# EAGLE design breakout (EAGLE 7.5.0)
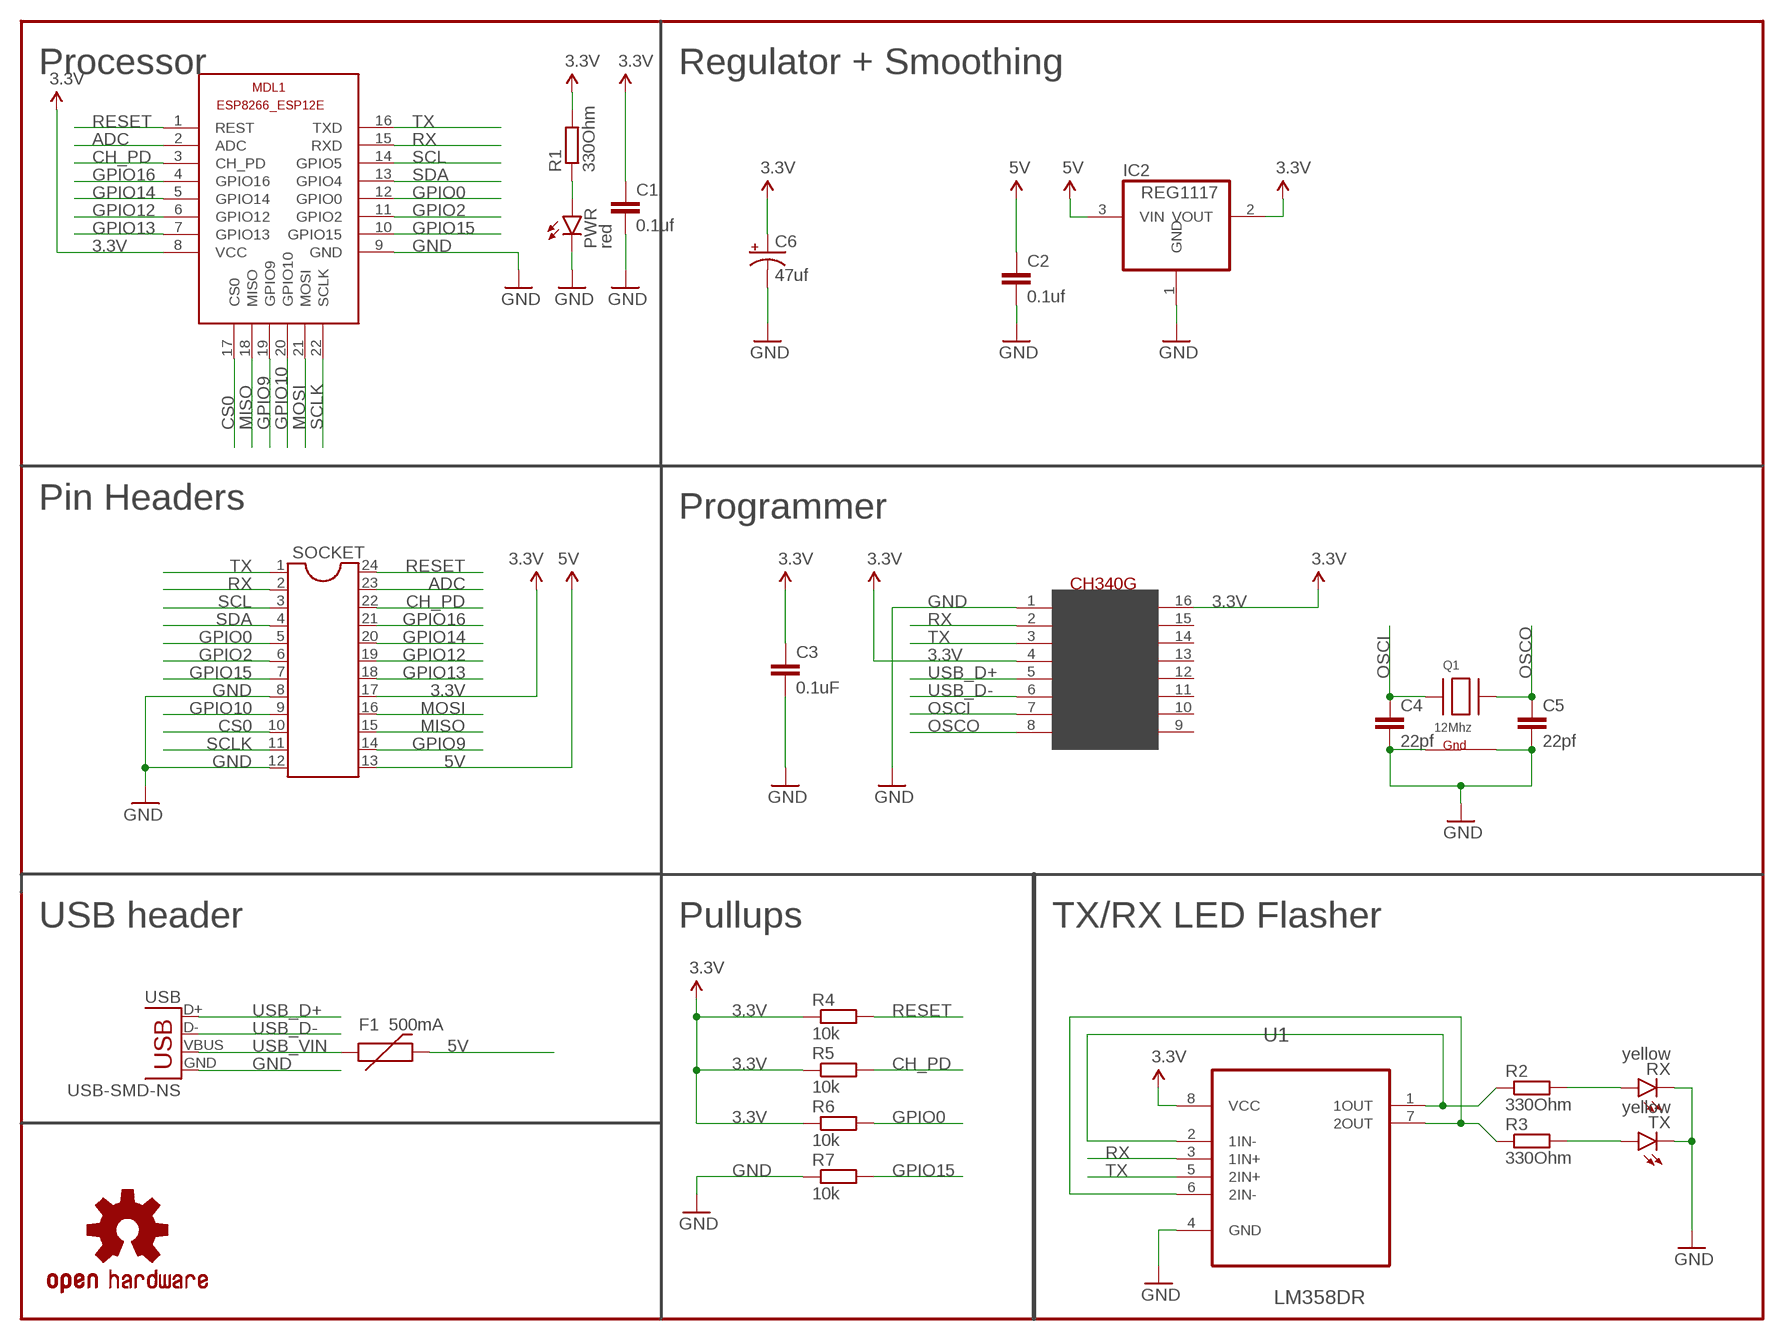
[diagram p0: schematic, sheet 1]

## Parts
C1  0.1uf  C-EUC0805  [C0805]
C2  0.1uf  C-EUC0805  [C0805]
C3  0.1uF  C-EUC0805  [C0805]
C4  22pf  C-EUC0805  [C0805]
C5  22pf  C-EUC0805  [C0805]
C6  47uf  CAP_POLC  [PANASONIC_C]
F1  500mA  PTCSMD  [PTC-1206]
FRAME1  FRAME-LETTERNO_PACKAGE  [DUMMY]
IC2  REG1117  [SOT223]
LOGO1  OSHW-LOGOS  [OSHW-LOGO-S]
MDL1  ESP8266-12EESP8266-ESP12E  [ESP8266-ESP12E]
PWR  red  LED0603  [LED-0603]
Q1  12Mhz  XTAL-4-3225  [NX3225]
R1  330Ohm  R-EU_R0805  [R0805]
R2  330Ohm  R-EU_R0805  [R0805]
R3  330Ohm  R-EU_R0805  [R0805]
R4  10k  R-EU_R0805  [R0805]
R5  10k  R-EU_R0805  [R0805]
R6  10k  R-EU_R0805  [R0805]
R7  10k  R-EU_R0805  [R0805]
RX  yellow  LED0603  [LED-0603]
SOCKET  DIL24-9  [DIL24-9]
TX  yellow  LED0603  [LED-0603]
U1  LM358DR  [SOIC127P600X175-8N]
U$1  CH340G  [SOIC16]
USB  USB-SMD-NS  [USB-MINIB-NOSTOP]

## Nets
3.3V: C1.1 C3.1 C6.+ IC2.2(VOUT) MDL1.8(VCC) R1.2 R4.1 R5.1 R6.1 SOCKET.17 U1.8(VCC) U$1.4(V3) U$1.16(VCC)
5V: C2.1 F1.2 IC2.3(VIN) SOCKET.13
ADC: MDL1.2(ADC) SOCKET.23
CH_PD: MDL1.3(CH_PD) R5.2 SOCKET.22
CS0: MDL1.17(CS0) SOCKET.10
GND: C1.2 C2.2 C3.2 C4.2 C5.2 C6.- IC2.1(GND) MDL1.9(GND) PWR.C Q1.2(G2) Q1.4(G1) R7.1 RX.C SOCKET.8 SOCKET.12 TX.C U1.4(GND) U$1.1(GND) USB.GND
GPIO0: MDL1.12(GPIO0) R6.2 SOCKET.5
GPIO2: MDL1.11(GPIO2) SOCKET.6
GPIO9: MDL1.19(GPIO9) SOCKET.14
GPIO10: MDL1.20(GPIO10) SOCKET.9
GPIO12: MDL1.6(GPIO12) SOCKET.19
GPIO13: MDL1.7(GPIO13) SOCKET.18
GPIO14: MDL1.5(GPIO14) SOCKET.20
GPIO15: MDL1.10(GPIO15) R7.2 SOCKET.7
GPIO16: MDL1.4(GPIO16) SOCKET.21
MISO: MDL1.18(MISO) SOCKET.15
MOSI: MDL1.21(MOSI) SOCKET.16
N$1: PWR.A R1.1
N$2: R3.2 TX.A
N$3: R2.1 U1.1(1OUT) U1.2(1IN-)
N$4: R3.1 U1.6(2IN-) U1.7(2OUT)
N$5: R2.2 RX.A
OSCI: C4.1 Q1.1(X1) U$1.7(XI)
OSCO: C5.1 Q1.3(X2) U$1.8(XO)
RESET: MDL1.1(REST) R4.2 SOCKET.24
RX: MDL1.15(RXD) SOCKET.2 U1.3(1IN+) U$1.2(TX)
SCL: MDL1.14(GPIO5) SOCKET.3
SCLK: MDL1.22(SCLK) SOCKET.11
SDA: MDL1.13(GPIO4) SOCKET.4
TX: MDL1.16(TXD) SOCKET.1 U1.5(2IN+) U$1.3(RX)
USB_D+: U$1.5(D+) USB.D+
USB_D-: U$1.6(D-) USB.D-
USB_VIN: F1.1 USB.VBUS
Unconnected: U$1.9(CTS) U$1.10(DSR) U$1.11(RI) U$1.12(DCD) U$1.13(DTR) U$1.14(RTS) U$1.15(RS232)

## Notes on the sheet
- Processor | Regulator + Smoothing
- Pin Headers
- Programmer
- USB header | Pullups | TX/RX LED Flasher

## Library data of the parts
C1-C5 = rcl:C-EU: CAPACITOR, European symbol
C6 = SparkFun:CAP_POL: Capacitor Polarized These are standard SMD and PTH capacitors. Normally 10uF, 47uF, and 100uF in electrolytic and tantalum varieties. Always verify the external diameter of the through hole cap, it varies with capacity, voltage, and manufacturer. The EIA devices should be standard.
F1 = SparkFun:PTC: Resettable Fuse PTC Resettable Fuse. Spark Fun Electronics SKU : COM-08357
FRAME1 = SparkFun-Aesthetics:FRAME-LETTER: Schematic Frame Standard 8.5x11 US Letter frame; DESIGNER: Nobody; VERSION: v01
IC2 = burr-brown:REG1117: 800mA and 1A Low Dropout (LDO) Positive Regulator 1.8V, 2.5V, 2.85V, 3.3V, 5V, and Adj; MPN: REG1117; OC_FARNELL: 1097566; OC_NEWARK: 14P6981
LOGO1 = SparkFun-Aesthetics:OSHW-LOGO: Open Source Hardware Logo This logo indicates the piece of hardware it is found on incorporates a OSHW license and/or adheres to the definition of open source hardware found here: http://freedomdefined.org/OSHW
MDL1 = ESP8266-ESP12E:ESP8266-12E: ESP8266-12E with additional I/O and GPIO04/05 corrected The author cannot warrant that this library is free from error or will meet your specific requirements. Created by PuceBaboon.com. Komagane, Nagano, JAPAN
PWR RX TX = SparkFun-LED:LED: LEDs Standard schematic elements and footprints for 5mm, 3mm, 1206, and 0603 sized LEDs. 5mm - Spark Fun Electronics SKU : COM-00529 (and others)
Q1 = adafruit:XTAL-4: Classic 4-pin 3.2 x 2.5mm crystal
R1-R7 = rcl:R-EU_: RESISTOR, European symbol
SOCKET = ic-package:DIL24: Dual In Line
U1 = Texas Instruments_By_element14_Batch_1:LM358DR: OPERATIONAL AMPLIFIERS; MPN: LM358DR; OC_FARNELL: 1831865; OC_NEWARK: 34K7599; PACKAGE: SOIC-8; SUPPLIER: Texas Instruments
U$1 = CH340G-USB-SERIAL:CH340G
USB = SparkFun-Connectors:USB: USB Connectors USB-B-PTH is fully proven SKU : PRT-00139/CONN-08278 USB-miniB is fully proven SKU : PRT-00587 USB-A-PCB is untested. USB-A-H is throughly reviewed, but untested. Spark Fun Electronics SKU : PRT-00437 USB-B-SMT is throughly reviewed, but untested. Needs silkscreen touching up. USB-A-S has not been used/tested USB-MB-H has not been used/tested USB-MICROB has been used. CONN-09505

## Net classes
1 power: width 0.254 mm

## Board
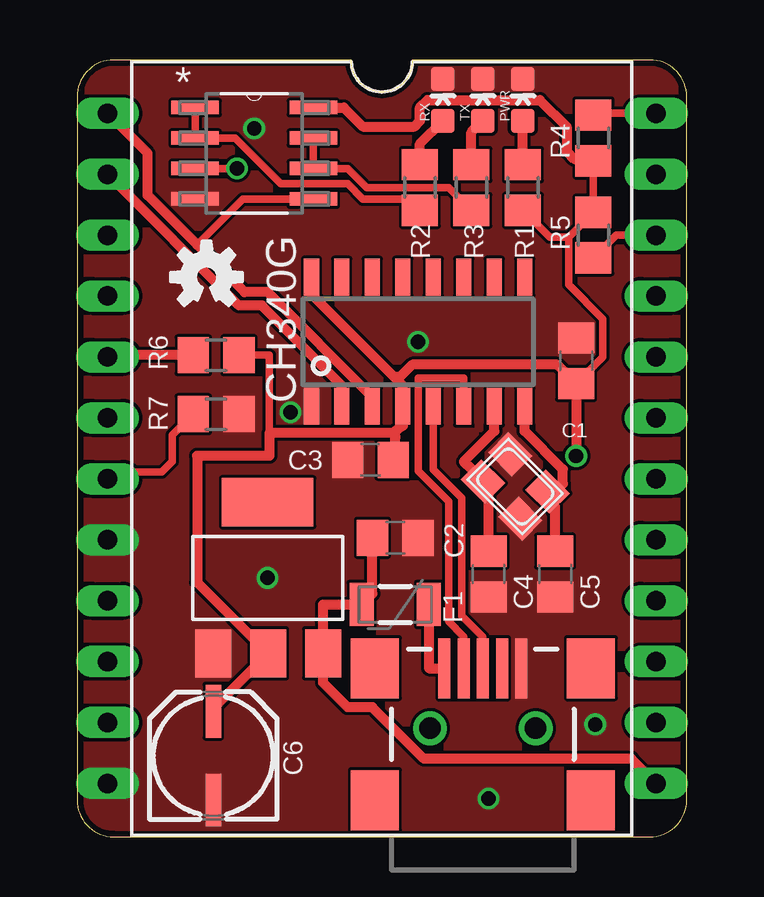
[diagram p1: board, top side]
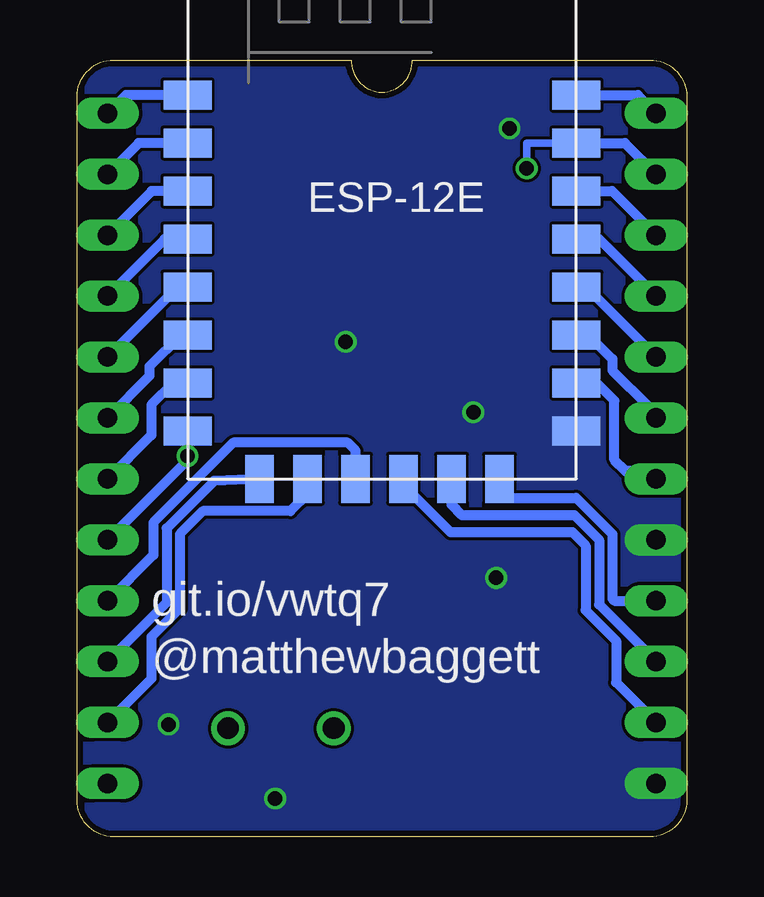
[diagram p2: board, bottom side, seen from below]

Size 25.4 x 32.38 mm. Coordinates in mm from the lower left corner, seen from the top.
Outline: 1.52,0 23.88,0 arc90 25.4,1.52 25.4,30.86 arc90 23.88,32.38 13.97,32.38 arc-90 12.7,31.04 arc-90 11.43,32.38 1.52,32.38 arc90 0,30.86 0,1.52 arc90 1.52,0
Copper layers (1*16): Top 0.035mm / dielectric 1.5mm / Bottom 0.035mm
Design rules "dirtypcbs": minimum track width 5mil, minimum drill 12mil, track to track 5mil, track to pad 5mil, pad to pad 5mil, via to via 5mil, smd to smd 0mil, copper to edge 10mil, drill to drill 10mil, minimum pad ring 10mil, minimum via ring 6mil, stop-mask expansion 2mil, vias tented up to drill 25mil, thermal gap 10mil

### Footprints (pad centres in the part's own frame; a part is rotated, then mirrored left to right if it is on the bottom)
C0805 = smd 1.3 x 1.5: 1 -0.95,0; 2 0.95,0
PANASONIC_C = smd 2.2 x 0.65: + 1.9,-0.2; - -1.8,-0.2
PTC-1206 = smd 1 x 1.8: 1 -1.4,0; 2 1.4,0
SOT223 = smd 1.499 x 2.007: 1 -2.261,-3.15; 2 0.025,-3.15; 3 2.311,-3.15 | smd 3.81 x 2.007: 4 0,3.15
ESP8266-ESP12E = smd 2 x 1.2: 1 0,16; 2 0,14; 3 0,12; 4 0,10; 5 0,8; 6 0,6; 7 0,4; 8 0,2; 9 16.2,2; 10 16.2,4; 11 16.2,6; 12 16.2,8; 13 16.2,10; 14 16.2,12; 15 16.2,14; 16 16.2,16 | smd 1.2 x 2: 17 11,0; 18 3,0; 19 5,0; 20 13,0; 21 7,0; 22 9,0
LED-0603 = smd 1 x 1: A 0,-0.877; C 0,0.877
NX3225 = smd 1.4 x 1.2: 1 -1.1,-0.8; 2 1.1,-0.8; 3 1.1,0.8; 4 -1.1,0.8
R0805 = smd 1.3 x 1.5: 1 -0.95,0; 2 0.95,0
DIL24-9 = drill 0.813 long: 1 -13.97,-11.43; 2 -11.43,-11.43; 3 -8.89,-11.43; 4 -6.35,-11.43; 5 -3.81,-11.43; 6 -1.27,-11.43; 7 1.27,-11.43; 8 3.81,-11.43; 9 6.35,-11.43; 10 8.89,-11.43; 11 11.43,-11.43; 12 13.97,-11.43; 13 13.97,11.43; 14 11.43,11.43; 15 8.89,11.43; 16 6.35,11.43; 17 3.81,11.43; 18 1.27,11.43; 19 -1.27,11.43; 20 -3.81,11.43; 21 -6.35,11.43; 22 -8.89,11.43; 23 -11.43,11.43; 24 -13.97,11.43
SOIC127P600X175-8N = smd 1.981 x 0.559: 1 -2.464,1.905; 2 -2.464,0.635; 3 -2.464,-0.635; 4 -2.464,-1.905; 5 2.464,-1.905; 6 2.464,-0.635; 7 2.464,0.635; 8 2.464,1.905
SOIC16 = smd 0.635 x 1.524: 1 -4.445,-2.695; 2 -3.175,-2.695; 3 -1.905,-2.695; 4 -0.635,-2.695; 5 0.635,-2.695; 6 1.905,-2.695; 7 3.175,-2.695; 8 4.445,-2.695; 9 4.445,2.695; 10 3.175,2.695; 11 1.905,2.695; 12 0.635,2.695; 13 -0.635,2.695; 14 -1.905,2.695; 15 -3.175,2.695; 16 -4.445,2.695
USB-MINIB-NOSTOP = smd 2.5 x 0.5: D+ 2.5,0; D- 2.5,0.8; GND 2.5,-1.6; ID 2.5,-0.8; VBUS 2.5,1.6 | smd 2.5 x 2: G1 -3,-4.5; G2 -3,4.5; G3 2.5,4.5; G4 2.5,-4.5 | drill 0.9 pad 0.8: H1 0,2.2 | drill 0.9 pad 0.787: H2 0,-2.2

### Placement (x,y rotation side)
C1  20.8,19.84 90 top
C2  13.26,12.46 0 top
C3  12.22,15.72 180 top
C4  17.14,10.95 270 top
C5  19.92,10.95 270 top
C6  5.48,3.33 90 top
F1  13.26,9.68 180 top
FRAME1  0.32,-4.29 0 bottom  (outside the outline)
IC2  7.94,10.79 0 top
LOGO1  5.4,23.34 0 top
MDL1  20.8,14.92 0 bottom
PWR  18.57,30.72 0 top
Q1  18.26,14.61 315 top
R1  18.57,27.07 270 top
R2  14.29,27.07 90 top
R3  16.43,27.07 90 top
R4  21.51,29.13 90 top
R5  21.51,25.08 270 top
R6  5.79,20.08 180 top
R7  5.79,17.62 180 top
RX  15.24,30.72 0 top
SOCKET  12.7,16.19 270 top
TX  16.91,30.72 0 top
U1  7.38,28.5 0 top
U$1  14.21,20.64 0 top
USB  16.91,4.52 90 top

### Tracks (layer width: path | path; a pad name or v marks a point on that pad's centre or on a via)
3.3V  (via drill 0.6)
  Top 0.305: R4.1 R5.1 20.48,25 | 20.48,25 20.48,23.02 21.91,21.59 21.91,20 C1.1 | R1.2 19.69,25 20.48,25 | R6.1 8.02,20.08 8.02,16.83
  Top 0.406: v20.8,15.88 C1.1 20,19.68 13.97,19.68 13.45,19.17 13.22,19.17 | 13.22,19.17 13.57,18.81 U$1.4 13.57,17.14 13.18,16.83 | 13.22,19.17 9.76,22.62 U$1.16 | 13.18,16.83 8.02,16.83 8.02,15.88 5,15.88 5,10.61 IC2.2 5.68,5.36 C6.+ | 13.18,16.83 13.26,16.75 13.25,16.75 C3.1 | U1.8 11.11,30.4 11.91,29.61 14.05,29.61 14.29,29.84 14.29,30.4 14.61,30.72 19.29,30.72 20.4,29.61 20.4,28.57 20.72,28.26 21.43,28.26 R4.1
  Bottom 0.406: SOCKET.17 20.8,15.72 v20.8,15.88 MDL1.8
5V
  Top 0.406: SOCKET.13 23.1,3.25 14.45,3.25 12.3,5.4 11.27,5.4 10.25,6.42 IC2.3 10.25,9.68 F1.2 12.31,10.13 C2.1
ADC
  Bottom 0.406: MDL1.2 22.83,28.92 SOCKET.23
CH_PD
  Top 0.305: R5.2 22.46,25.08 SOCKET.22
  Bottom 0.406: MDL1.3 22.29,26.92 SOCKET.22
CS0
  Bottom 0.406: MDL1.17 9.8,13.84 9.37,13.41 4.68,13.41 3.65,12.38 3.65,9.68 SOCKET.10
GND  (via drill 0.6)
  other vias: 7.38,29.53 21.59,4.68 8.89,17.7 7.94,10.79 14.21,20.64 17.14,1.59
  pour Bottom (no thermals): 0,0 25.4,0 25.4,32.38 0,32.38
  pour Top (no thermals): 0,0 25.4,0 25.4,32.38 0,32.38
GPIO0
  Top 0.406: R6.2 1.35,20.08 SOCKET.5
  Bottom 0.406: MDL1.12 4.19,22.92 SOCKET.5
GPIO2
  Bottom 0.406: MDL1.11 4.09,20.92 3.1,19.92 3.1,19.45 1.59,17.94 1.59,17.78 SOCKET.6
GPIO9
  Bottom 0.406: MDL1.19 15.8,14.29 16.51,13.57 20.16,13.57 21.11,12.62 21.11,9.53 22.3,8.33 22.3,6.59 SOCKET.14
GPIO10
  Bottom 0.406: MDL1.20 7.8,14.15 7.78,14.13 4.6,14.13 3.1,12.62 3.1,9.92 3.02,9.84 SOCKET.9
GPIO12
  Bottom 0.406: MDL1.6 21.07,20.92 22.38,19.61 22.38,19.21 SOCKET.19
GPIO13
  Bottom 0.406: MDL1.7 21.4,18.92 22.3,18.02 22.3,16.75 SOCKET.18
GPIO14
  Bottom 0.406: MDL1.5 21.21,22.92 SOCKET.20
GPIO15
  Top 0.305: R7.2 3.97,16.75 3.97,15.64 3.53,15.2 1.71,15.2
  Top 0.406: 1.71,15.2 1.55,15.2 SOCKET.7
  Bottom 0.406: SOCKET.7 1.43,14.92 1.59,15.24 2.54,15.24 3.02,15.72 3.02,18.18 3.81,18.97 4.55,18.97 MDL1.10
GPIO16
  Bottom 0.406: MDL1.4 21.75,24.92 SOCKET.21
MISO
  Bottom 0.406: MDL1.18 19.68,14.84 21.67,12.86 21.67,9.76 SOCKET.15
MOSI
  Bottom 0.406: MDL1.21 13.8,16.1 14.13,16.43 18.89,16.43 22.23,13.1 22.23,11.75 SOCKET.16
N$1
  Top 0.406: R1.1 PWR.A
N$2
  Top 0.406: R3.2 16.43,29.36 TX.A
N$3
  Top 0.305: U1.1 U1.2 6.59,29.13 8.49,27.23 11.27,27.23 11.91,26.59 13.81,26.59 R2.1
N$4
  Top 0.305: U1.7 U1.6 11.27,27.86 12.06,27.07 15.48,27.07 R3.1
N$5
  Top 0.406: R2.2 14.29,28.89 RX.A
OSCI
  Top 0.406: U$1.7 17.38,16.91 16.11,15.64 17.07,14.76 Q1.1 17.14,14.43 C4.1
OSCO
  Top 0.406: U$1.8 18.65,16.91 20.24,15.32 20.24,14.72 Q1.3 19.92,13.75 C5.1
RESET
  Top 0.305: R4.2 21.59,30.16 SOCKET.24
  Bottom 0.406: MDL1.1 23.37,30.92 SOCKET.24
RX  (via drill 0.6)
  Top 0.305: U1.3 v6.67,27.86
  Top 0.406: U$1.2 11.03,18.81 7.7,22.15 6.75,22.15 SOCKET.2
  Bottom 0.305: v6.67,27.86 6.67,28.92 MDL1.15
  Bottom 0.406: MDL1.15 2.57,28.92 SOCKET.2
SCL
  Bottom 0.406: MDL1.14 3.11,26.92 SOCKET.3
SCLK
  Bottom 0.406: MDL1.22 11.8,14.65 9.84,12.7 4.76,12.7 4.21,12.14 4.21,9.45 2.94,8.18 2.94,6.43 SOCKET.11
SDA
  Bottom 0.406: MDL1.13 3.65,24.92 SOCKET.4
TX
  Top 0.305: U1.5 6.91,26.59 5,24.69
  Top 0.406: U$1.3 12.3,18.34 7.94,22.7 6.99,22.7 5,24.69 2.94,26.75 2.94,28.5 SOCKET.1
  Bottom 0.406: MDL1.16 2.03,30.92 SOCKET.1
USB_D+
  Top 0.305: U$1.5 14.84,15.32 16.03,14.13 16.03,9.21 16.91,8.33 USB.D+
USB_D-
  Top 0.305: USB.D- 16.11,8.33 15.48,8.97 15.48,13.97 14.21,15.24 14.21,19.13 16.11,19.13 U$1.6
USB_VIN
  Top 0.406: F1.1 14.66,7.02 USB.VBUS

### Text on the board
bNames: git.io/vwtq7 | @matthewbaggett